# EAGLE design pcg eletr (EAGLE 9.6.2)
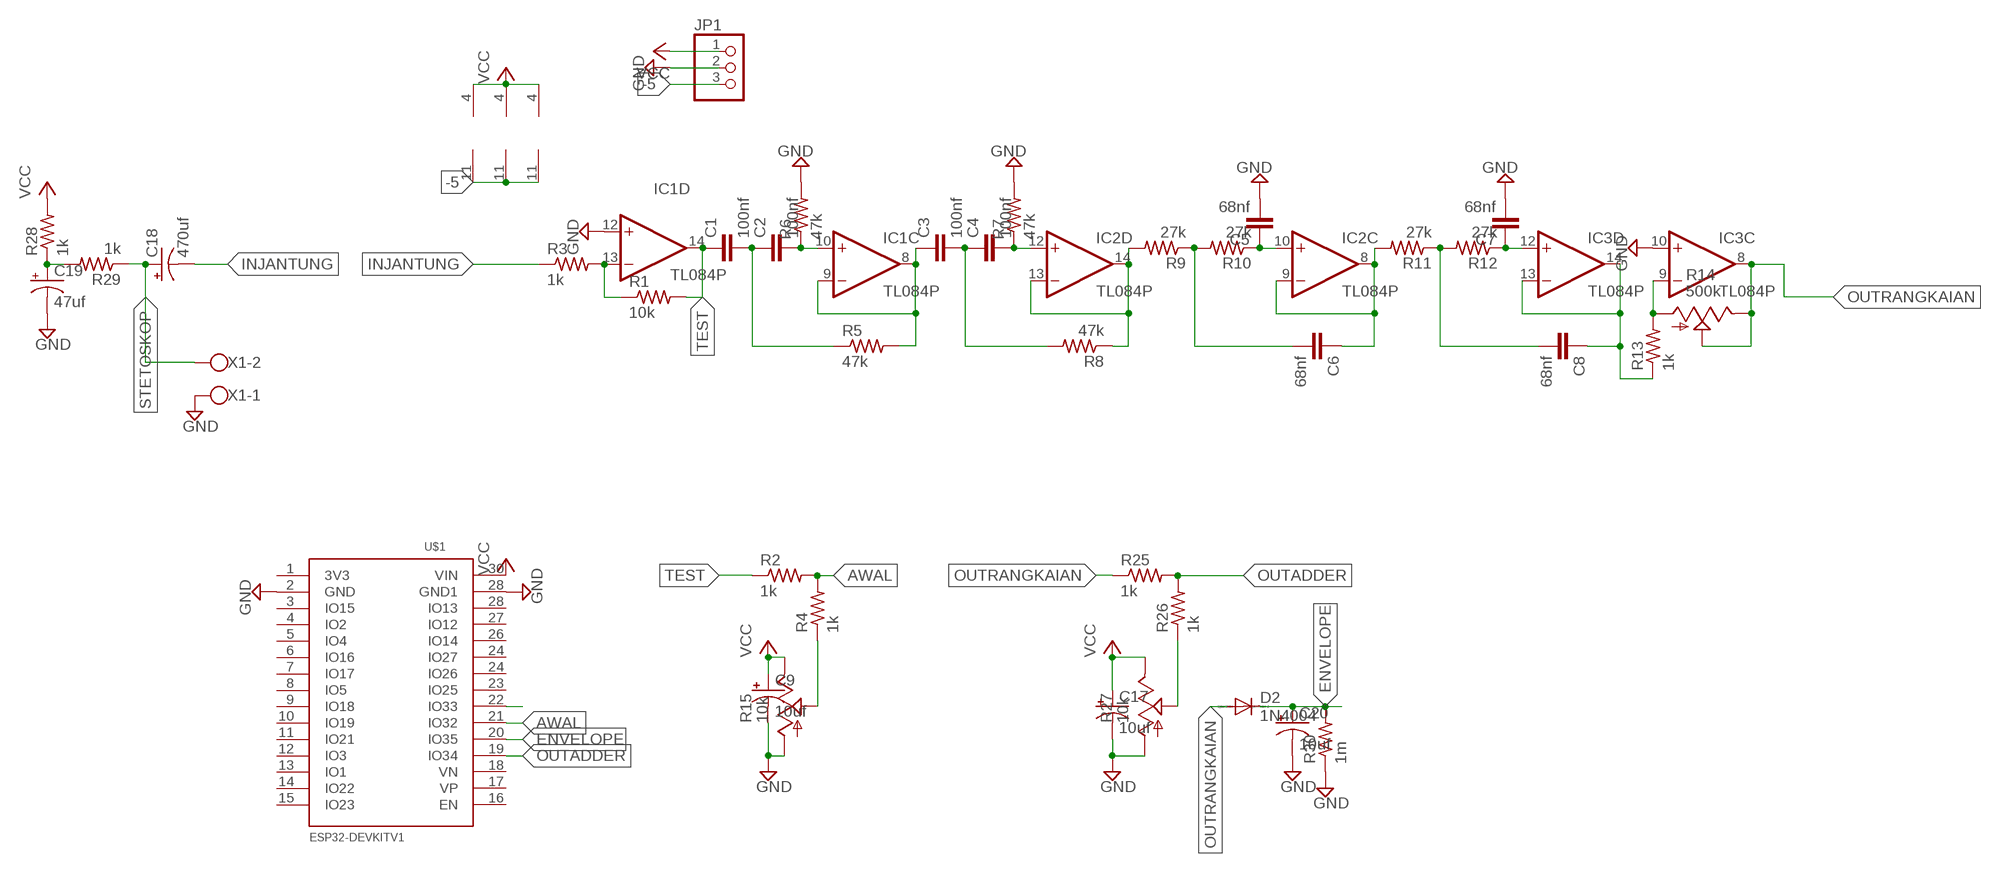
[diagram p0: schematic, sheet 1]

## Parts
C1  100nf  C-EU050-025X075  [C050-025X075]
C2  100nf  C-EU050-025X075  [C050-025X075]
C3  100nf  C-EU050-025X075  [C050-025X075]
C4  100nf  C-EU050-025X075  [C050-025X075]
C5  68nf  C-EU050-025X075  [C050-025X075]
C6  68nf  C-EU050-025X075  [C050-025X075]
C7  68nf  C-EU050-025X075  [C050-025X075]
C8  68nf  C-EU050-025X075  [C050-025X075]
C9  10uf  CPOL-USE2-5  [E2-5]
C17  10uf  CPOL-USE2-5  [E2-5]
C18  470uf  CPOL-USE2.5-7  [E2,5-7]
C19  47uf  CPOL-USE2-5  [E2-5]
C20  10uf  CPOL-USE2-5  [E2-5]
D2  1N4004  [DO41-10]
IC1  TL084P  [DIL14]
IC2  TL084P  [DIL14]
IC3  TL084P  [DIL14]
JP1  PINHD-1X3  [1X03]
R1  10k  R-US_0207/7  [0207/7]
R2  1k  R-US_0207/7  [0207/7]
R3  1k  R-US_0207/7  [0207/7]
R4  1k  R-US_0207/7  [0207/7]
R5  47k  R-US_0207/7  [0207/7]
R6  47k  R-US_0207/7  [0207/7]
R7  47k  R-US_0207/7  [0207/7]
R8  47k  R-US_0207/7  [0207/7]
R9  27k  R-US_0207/7  [0207/7]
R10  27k  R-US_0207/7  [0207/7]
R11  27k  R-US_0207/7  [0207/7]
R12  27k  R-US_0207/7  [0207/7]
R13  1k  R-US_0207/7  [0207/7]
R14  500k  TRIM_US-B64Y  [B64Y]
R15  10k  TRIM_US-B64Y  [B64Y]
R25  1k  R-US_0207/7  [0207/7]
R26  1k  R-US_0207/7  [0207/7]
R27  10k  TRIM_US-B64Y  [B64Y]
R28  1k  R-US_0207/7  [0207/7]
R29  1k  R-US_0207/7  [0207/7]
R30  1m  R-US_0207/7  [0207/7]
U$1  ESP32DEVKITV1  [ESP32-DEVKITV1]
X1  W237-102  [W237-102]

## Nets
-5: IC1.11(P:V-) IC2.11(P:V-) IC3.11(P:V-) JP1.3
AWAL: R2.2 R4.2 U$1.21(IO32)
ENVELOPE: C20.+ D2.C R30.2 U$1.20(IO35)
GND: C5.2 C7.2 C9.- C17.- C19.- C20.- IC1.12(D:+IN) IC3.10(C:+IN) JP1.2 R6.2 R7.2 R15.A R27.A R30.1 U$1.2(GND) U$1.28(GND1) X1.1
INJANTUNG: C18.- R3.1
N$1: IC1.13(D:-IN) R1.1 R3.2
N$2: R4.1 R15.S
N$7: C1.2 C2.1 R5.1
N$8: C2.2 IC1.10(C:+IN) R6.1
N$9: C3.1 IC1.8(C:OUT) IC1.9(C:-IN) R5.2
N$10: C3.2 C4.1 R8.2
N$11: C4.2 IC2.12(D:+IN) R7.1
N$12: IC2.13(D:-IN) IC2.14(D:OUT) R8.1 R9.2
N$13: C6.2 R9.1 R10.2
N$14: C5.1 IC2.10(C:+IN) R10.1
N$15: C6.1 IC2.8(C:OUT) IC2.9(C:-IN) R11.2
N$16: C8.2 R11.1 R12.2
N$17: C7.1 IC3.12(D:+IN) R12.1
N$18: C8.1 IC3.13(D:-IN) IC3.14(D:OUT) R13.1
N$19: IC3.9(C:-IN) R13.2 R14.A
N$24: U$1.22(IO33)
N$38: R26.1 R27.S
N$39: C19.+ R28.1 R29.2
OUTADDER: R25.2 R26.2 U$1.19(IO34)
OUTRANGKAIAN: D2.A IC3.8(C:OUT) R14.E R14.S R25.1
STETOSKOP: C18.+ R29.1 X1.2
TEST: C1.1 IC1.14(D:OUT) R1.2 R2.1
VCC: C9.+ C17.+ IC1.4(P:V+) IC2.4(P:V+) IC3.4(P:V+) JP1.1 R15.E R27.E R28.2 U$1.30(VIN)
Unconnected: IC1.1(A:OUT) IC1.2(A:-IN) IC1.3(A:+IN) IC1.5(B:+IN) IC1.6(B:-IN) IC1.7(B:OUT) IC2.1(A:OUT) IC2.2(A:-IN) IC2.3(A:+IN) IC2.5(B:+IN) IC2.6(B:-IN) IC2.7(B:OUT) IC3.1(A:OUT) IC3.2(A:-IN) IC3.3(A:+IN) IC3.5(B:+IN) IC3.6(B:-IN) IC3.7(B:OUT) U$1.1(3V3) U$1.3(IO15) U$1.4(IO2) U$1.5(IO4) U$1.6(IO16) U$1.7(IO17) U$1.8(IO5) U$1.9(IO18) U$1.10(IO19) U$1.11(IO21) U$1.12(IO3) U$1.13(IO1) U$1.14(IO22) U$1.15(IO23) U$1.16(EN) U$1.17(VP) U$1.18(VN) U$1.23(IO25) U$1.24(IO26) U$1.24(IO27) U$1.26(IO14) U$1.27(IO12) U$1.28(IO13)

## Library data of the parts
C1-C8 = rcl:C-EU: CAPACITOR, European symbol; SPICEPREFIX: C
C9 C17-C20 = rcl:CPOL-US: POLARIZED CAPACITOR, American symbol; SPICEPREFIX: C
D2 = diode:1N4004: DIODE general purpose rectifier, 1 A
IC1-IC3 = linear:TL084: OP AMP
JP1 = pinhead:PINHD-1X3: PIN HEADER
R1-R13 R25 R26 R28-R30 = rcl:R-US_: RESISTOR, American symbol; SPICEPREFIX: R
R14 R15 R27 = pot:TRIM_US-: POTENTIOMETER
U$1 = ESP32-DEVKITV1:ESP32DEVKITV1
X1 = con-wago-500:W237-102: WAGO SCREW CLAMP; MPN: 237-102; OC_FARNELL: unknown; OC_NEWARK: 70K9898

## Board
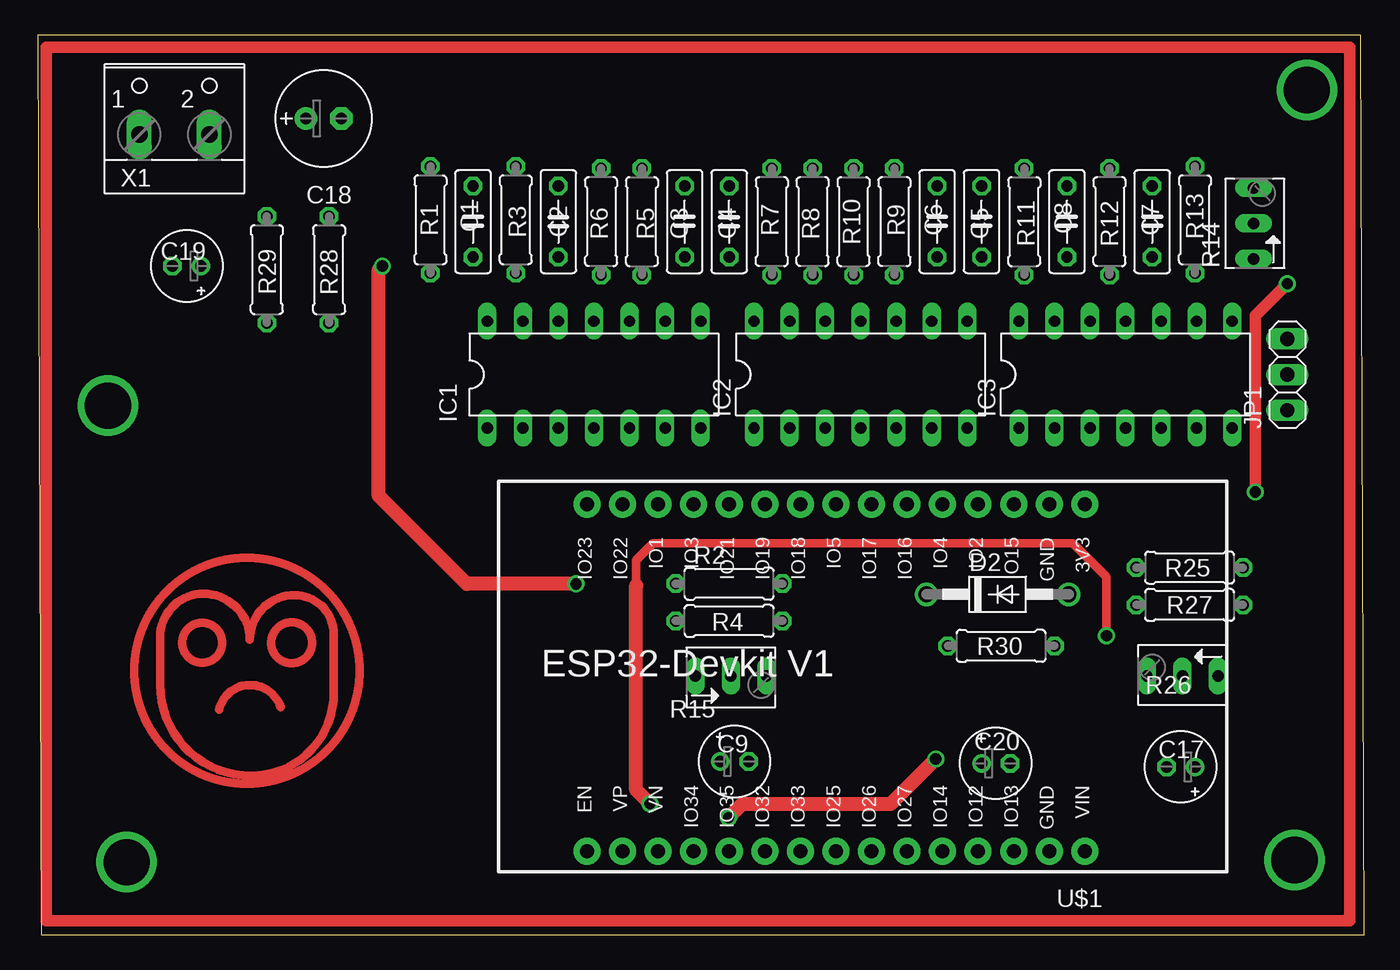
[diagram p1: board, top side]
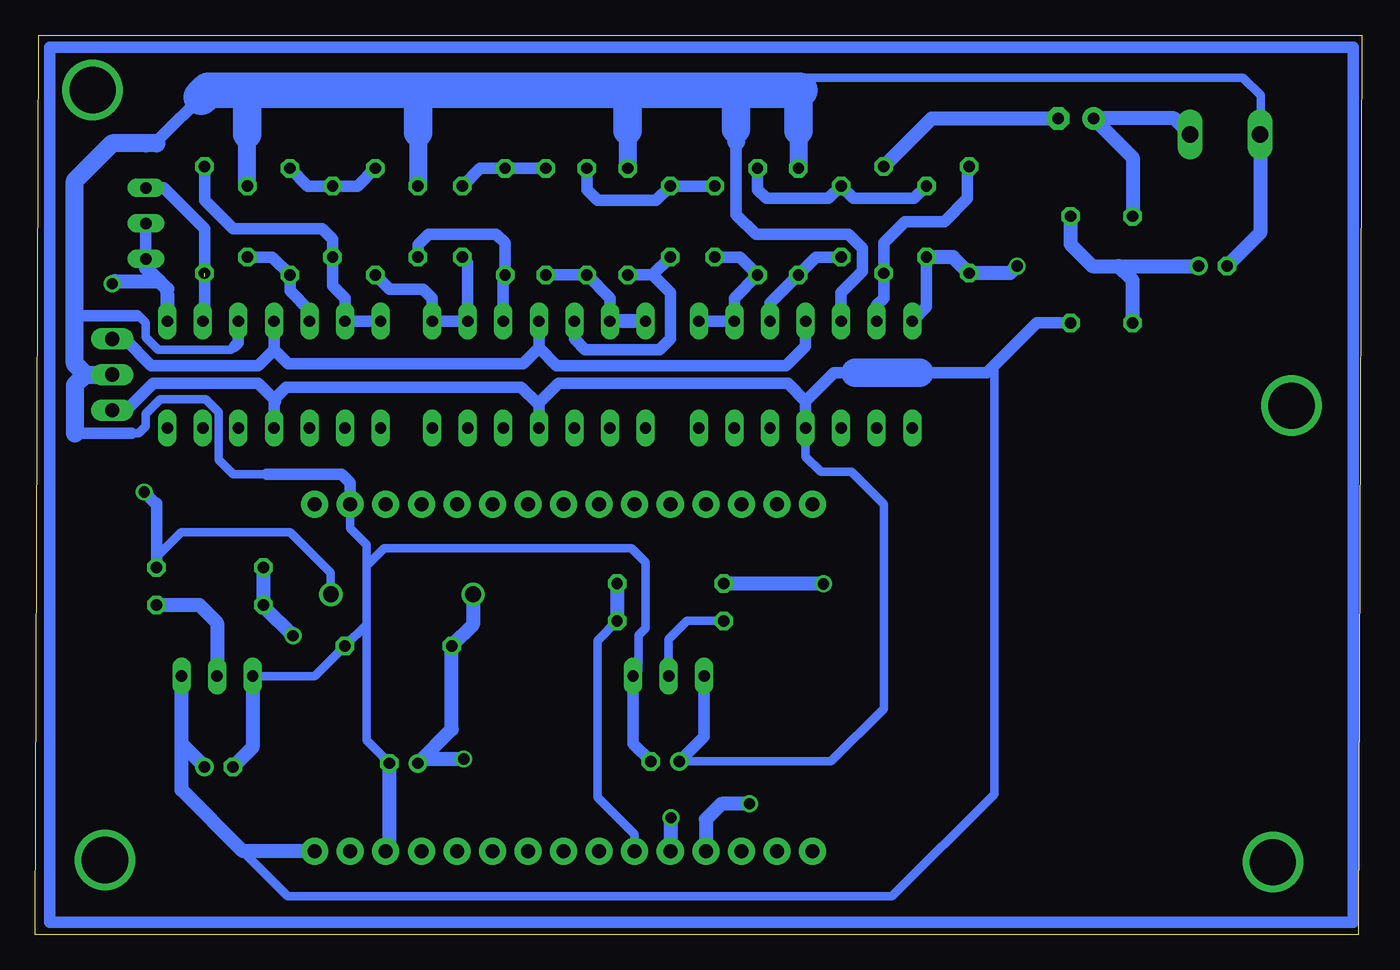
[diagram p2: board, bottom side, seen from below]

Size 94.79 x 64.25 mm. Coordinates in mm from the lower left corner, seen from the top.
Outline: 0.25,0 94.79,0 94.54,64.25 0,64.25 0.25,0
Copper layers (1*16): Top 0.035mm / dielectric 1.5mm / Bottom 0.035mm
Design rules "default": minimum track width 6mil, minimum drill 0.35mm, track to track 6mil, track to pad 6mil, pad to pad 6mil, via to via 6mil, smd to smd 6mil, copper to edge 40mil, drill to drill 6mil, minimum pad ring 10mil, minimum via ring 8mil, stop-mask expansion 4mil, vias tented up to drill 0mil, thermal gap 10mil

### Footprints (pad centres in the part's own frame; a part is rotated, then mirrored left to right if it is on the bottom)
C050-025X075 = drill 0.813 octagon: 1 -2.54,0; 2 2.54,0
E2-5 = drill 0.813 pad 1.27: + -1.016,0 | drill 0.813 pad 1.27 octagon: - 1.016,0
E2,5-7 = drill 0.813 pad 1.6: + -1.27,0 | drill 0.813 pad 1.6 octagon: - 1.27,0
DO41-10 = drill 1.118: A 5.08,0; C -5.08,0
DIL14 = drill 0.813 long: 1 -7.62,-3.81; 2 -5.08,-3.81; 3 -2.54,-3.81; 4 0,-3.81; 5 2.54,-3.81; 6 5.08,-3.81; 7 7.62,-3.81; 8 7.62,3.81; 9 5.08,3.81; 10 2.54,3.81; 11 0,3.81; 12 -2.54,3.81; 13 -5.08,3.81; 14 -7.62,3.81
1X03 = drill 1.016 long: 1 -2.54,0; 2 0,0; 3 2.54,0
0207/7 = drill 0.813 octagon: 1 -3.81,0; 2 3.81,0
B64Y = drill 0.813 long: A 2.54,0; E -2.54,0; S 0,0
ESP32-DEVKITV1 = drill 1 pad 1.93: 1 -22.87,-13.54; 2 -20.33,-13.54; 3 -17.79,-13.54; 4 -15.25,-13.54; 5 -12.71,-13.54; 6 -10.17,-13.54; 7 -7.63,-13.54; 8 -5.09,-13.54; 9 -2.55,-13.54; 10 -0.01,-13.54; 11 2.53,-13.54; 12 5.07,-13.54; 13 7.61,-13.54; 14 10.15,-13.54; 15 12.69,-13.54; 16 12.69,11.23; 17 10.15,11.23; 18 7.61,11.23; 19 5.07,11.23; 20 2.53,11.23; 21 -0.01,11.23; 22 -2.55,11.23; 23 -5.09,11.23; 24 -7.63,11.23; 25 -10.17,11.23; 26 -12.71,11.23; 27 -15.25,11.23; 28 -17.79,11.23; 29 -20.33,11.23; 30 -22.87,11.23
W237-102 = drill 1.194 long: 1 -2.5,-1.27; 2 2.5,-1.27

### Placement (x,y rotation side)
C1  31.11,50.93 90 top
C2  37.21,50.93 270 top
C3  46.23,50.93 90 top
C4  49.4,50.93 270 top
C5  67.44,50.93 90 top
C6  64.26,50.93 90 top
C7  79.63,50.93 90 top
C8  73.53,50.93 90 top
C9  49.78,12.38 0 top
C17  81.66,12 180 top
C18  20.45,58.29 0 top
C19  10.67,47.75 180 top
C20  68.45,12.25 0 top
D2  68.58,24.31 0 top
IC1  39.75,40.01 0 top
IC2  58.8,40.01 0 top
IC3  77.72,40.01 0 top
JP1  89.28,40.01 90 top
R1  28.07,51.05 270 top
R2  49.4,25.08 0 top
R3  34.16,51.05 270 top
R4  49.4,22.41 0 top
R5  43.18,50.93 270 top
R6  40.26,50.93 90 top
R7  52.45,50.93 90 top
R8  55.37,50.93 90 top
R9  58.29,50.93 270 top
R10  61.21,50.93 90 top
R11  70.48,50.93 270 top
R12  76.58,50.93 90 top
R13  82.68,51.05 270 top
R14  86.87,50.8 90 top
R15  49.53,18.47 0 top
R25  82.3,26.22 180 top
R26  82.3,23.55 180 top
R27  81.79,18.47 180 top
R28  20.83,47.5 270 top
R29  16.38,47.5 270 top
R30  68.83,20.63 180 top
U$1  51.94,17.2 180 top
X1  9.78,58.42 0 top

### Tracks (layer width: path | path; a pad name or v marks a point on that pad's centre or on a via)
-5
  Bottom 0.813: IC1.11 39.75,42.04 41.15,40.64 57.53,40.64 58.8,41.91 | IC2.11 58.8,41.91 | 58.8,41.91 59.94,40.77 76.71,40.77 77.72,41.78 | IC3.11 77.72,41.78 | 77.72,41.78 77.72,41.66 | JP1.3 88.39,42.55 86.49,40.64 78.87,40.64 77.72,41.78
AWAL
  Bottom 0.61: R4.2 54.61,21.01 54.61,9.84 51.95,7.18 U$1.21
  Bottom 1.016: R2.2 R4.2
ENVELOPE  (via drill 0.8)
  Top 1.016: v49.36,8.36 50.36,9.36 58.96,9.36 60.96,9.36 v64.16,12.55
  Bottom 1.016: D2.C 63.5,22.16 R30.2 65.02,14.66 C20.+ 67.13,12.55 v64.16,12.55 | U$1.20 49.36,6.02 v49.36,8.36
GND
  Bottom 0.61: 80.52,42.04 80.77,41.78 85.98,41.78 86.87,42.67 86.87,43.69 87.38,44.2 87.5,44.2 | 87.88,35.81 87.38,35.81 86.87,36.32 86.87,37.21 85.85,38.23 82.59,38.23 81.69,37.32 81.69,33.93 80.65,32.89 78.23,32.89 | 71.12,22.16 R30.1 74.8,18.47 R27.A | U$1.2 72.27,29.02 71.12,27.87 71.12,26.36 | 71.12,22.16 71.12,26.36 | 71.12,22.16 71.12,13.9 C20.- | 42.67,60.32 41.78,61.21 8.51,61.21 7.24,59.94 7.24,57.19 X1.1 | R15.A 51.69,18.85 51.69,21.39 51.18,21.9 51.18,26.6 52.2,27.62 69.86,27.62 71.12,26.36
  Bottom 0.813: 89.41,39.88 JP1.2 | IC1.12 37.21,45.85 35.69,47.37 35.69,49.02 36.7,50.04 43.31,50.04 44.7,51.44 44.7,56.64 | 44.45,60.32 44.7,60.07 | IC3.10 80.26,42.29 80.52,42.04 | 87.5,44.2 91.95,44.2 | 91.95,35.81 87.88,35.81 | U$1.2 72.27,32.27 72.9,32.89 78.23,32.89 | 86.23,56.52 82.42,60.32 | 86.23,56.52 86.11,56.52 | 86.23,56.52 86.87,56.52 | R15.A 52.07,13.65 C9.-
  Bottom 1.016: R27.A 79.25,13.39 C17.- | X1.1 7.28,50.12 C19.- | U$1.28 69.47,6.24 C20.-
  Bottom 1.27: 91.19,40.01 JP1.2 | 91.19,40.01 91.95,40.77 91.95,44.2 91.95,53.85 89.28,56.52 86.87,56.52 86.11,56.52 | 91.19,40.01 91.95,39.24 91.95,35.81 | 40.13,60.32 40.26,60.2 40.26,59.31 | 40.26,57.4 R6.2 | 52.58,60.32 52.45,60.2 | 52.45,57.4 R7.2 | 67.44,57.28 C5.2 | 82.93,59.82 82.55,59.44 | 44.7,57.53 44.7,56.64 | C7.2 79.63,57.15
  Bottom 2.032: 79.5,60.32 79.63,60.2 79.63,57.15 | 67.31,60.32 67.44,60.2 67.44,57.28 | 44.7,60.07 44.7,57.53 | 40.26,59.31 40.26,57.4 | 52.45,60.2 52.45,57.4
  Bottom 2.54: 82.93,59.82 82.42,60.32 79.5,60.32 67.31,60.32 52.58,60.32 44.45,60.32 42.67,60.32 40.13,60.32
INJANTUNG
  Bottom 1.016: R3.1 30.73,58.29 C18.-
N$1
  Bottom 0.813: IC1.13 34.67,44.96 34.16,45.47 R3.2 34.16,49.4 32.64,50.93 29.85,50.93 28.19,52.58 28.19,54.74 R1.1
N$2
  Bottom 0.61: R4.1 48.22,22.41 49.53,21.1 R15.S
N$3
  Top 0.61: 15.16,21.05 arc90 11.86,24.36 arc90 8.76,21.25 8.76,17.86 arc90 15.26,11.36 arc90 21.16,17.25 21.16,21.45 arc90 18.36,24.25 arc90 15.16,21.05
N$4
  Top 0.61: 12.96,16.05 arc-150 17.36,16.25
N$5
  Top 0.813: 0.64,63.37 0.64,0.99 93.73,0.99 93.73,63.37 0.64,63.37
N$7
  Bottom 0.813: C1.2 32,52.58 36.32,52.58 C2.1 38.1,52.58 42.55,52.58 43.18,53.21 R5.1
N$8
  Bottom 0.813: C2.2 38.99,48.39 R6.1 42.29,45.09 IC1.10
N$9
  Bottom 0.813: IC1.8 IC1.9 44.83,45.47 R5.2 44.45,48.39 C3.1
N$10
  Bottom 0.813: C3.2 C4.1 50.42,52.45 54.61,52.45 55.37,53.21 R8.2
N$11
  Bottom 0.813: 50.67,47.12 C4.2 | R7.1 50.67,47.12 | IC2.12 56.26,42.55 55.5,41.78 50.17,41.78 49.4,42.55 49.4,45.85 50.67,47.12
N$12
  Bottom 0.813: IC2.13 53.72,45.47 R8.1 R9.2
  Bottom 1.016: IC2.14 IC2.13
N$13
  Bottom 0.813: R9.1 R10.2 62.99,54.74 C6.2
N$14
  Bottom 0.813: IC2.10 61.34,46.99 R10.1 61.21,49.4 61.85,50.04 66.68,50.04 67.44,49.28 C5.1
N$15
  Bottom 0.813: IC2.8 IC2.9 63.88,48.01 C6.1 | 66.42,44.58 IC2.8 | IC2.8 66.42,45.47 67.06,46.1 69.47,46.1 R11.2
N$16
  Bottom 0.813: R11.1 71.76,53.47 C8.2 75.31,53.47 R12.2
N$17
  Bottom 0.813: IC3.12 75.18,44.58 76.58,45.97 R12.1 77.85,48.39 C7.1
N$18
  Bottom 0.813: IC3.14 IC3.13 72.64,45.47 73.53,46.35 C8.1 73.53,49.66 74.3,50.42 80.65,50.42 82.68,52.45 R13.1
N$19  (1 unrouted)
  Bottom 0.813: 82.68,46.99 82.68,43.94 IC3.9 | R14.A 85.6,53.34 82.68,50.42 R13.2
N$20  (via drill 3.3)
  other vias: 5.04,37.78
N$22  (via drill 3.3)
  other vias: 6.37,5.19
N$26  (via drill 3.3)
  other vias: 89.79,5.33
N$34  (via drill 3.3)
  other vias: 90.68,60.32
N$36
  Bottom 0.813: 93.73,0.89 0.64,0.89 0.64,63.37 93.73,63.37 93.73,0.89
N$38
  Bottom 1.016: R26.1 83.06,23.55 81.79,22.28 R27.S
N$39
  Bottom 1.016: R28.1 20.83,49.32 19.26,47.75 17.4,47.75 | 17.4,47.75 C19.+ | R29.2 16.38,46.74 17.4,47.75
OUTADDER  (via drill 0.8)
  Top 0.61: v76.36,21.36 76.36,25.55 73.96,27.95 43.96,27.95 42.76,26.75 42.76,24.95
  Top 1.016: v43.76,9.36 42.76,10.36 42.76,24.95
  Bottom 0.61: 78.49,25.36 78.49,23.48
  Bottom 0.813: R25.2 78.49,25.36 R26.2
  Bottom 1.016: R25.2 R26.2 78.49,23.48 v76.36,21.36 | v43.76,9.36 45.76,9.36 46.87,8.25 U$1.19
OUTRANGKAIAN  (via drill 0.8)
  Top 0.813: v89.28,46.48 87,44.2 v87,31.62
  Bottom 0.61: D2.A 73.66,25.85 76.56,28.76 84.36,28.76 86.11,27.01 R25.1
  Bottom 0.813: R14.S R14.E | 86.87,47.62 85.92,46.67 85.34,46.1 | 85.34,46.1 85.34,45.66 | 85.34,46.1 85.47,45.97 | R25.1 86.11,30.82 86.2,30.82 v87,31.62
  Bottom 1.016: v89.28,46.48 89.09,46.67 85.92,46.67 | R14.E 86.87,47.62 85.34,46.1 | 85.34,45.66 IC3.8
STETOSKOP
  Bottom 1.016: R29.1 16.38,55.5 C18.+ 13.42,58.29 X1.2
TEST  (via drill 0.8)
  Top 1.016: v24.64,47.75 24.38,47.5 24.38,31.34 30.66,25.05 v38.46,25.05
  Bottom 0.813: C1.1 31.11,44.83 IC1.14
  Bottom 1.016: v24.64,47.75 25.15,47.24 R1.2 29.21,48.39 C1.1 | v38.46,25.05 38.48,25.08 R2.1
VCC
  Bottom 0.61: IC1.4 39.75,34.14 38.66,33.05 36.46,33.05 34.16,30.76 34.16,16.16 37.94,12.38 C9.+ | 26.27,40.66 26.27,10.05 33.56,2.75 76.74,2.75 79.96,5.97
  Bottom 0.813: 39.75,38.1 IC1.4 | IC2.4 58.8,37.85 58.87,37.91 | 39.75,38.1 41.02,39.37 57.4,39.37 58.87,37.91 | 58.87,37.91 60.07,39.12 76.84,39.12 77.72,38.23 | IC3.4 77.72,37.97 77.6,38.1 77.72,38.23 | 39.75,38.1 37.72,40.13 36.2,40.13 | JP1.1 88.27,37.46 86.36,39.37 78.87,39.37 77.72,38.23 | 33.02,40.13 26.8,40.13 26.27,40.66 23.24,43.69 R28.2 | R15.E 46.99,14.15 C9.+
  Bottom 1.016: C17.+ 84.33,13.65 | 84.33,13.65 R27.E | U$1.30 79.96,5.97 84.33,10.34 84.33,13.65
  Bottom 2.032: 36.2,40.13 33.02,40.13 31.62,40.13
(copper drawn outside any net)
  shapes: Top circle x3

### Text on the board
tValues: -5 | g | +5